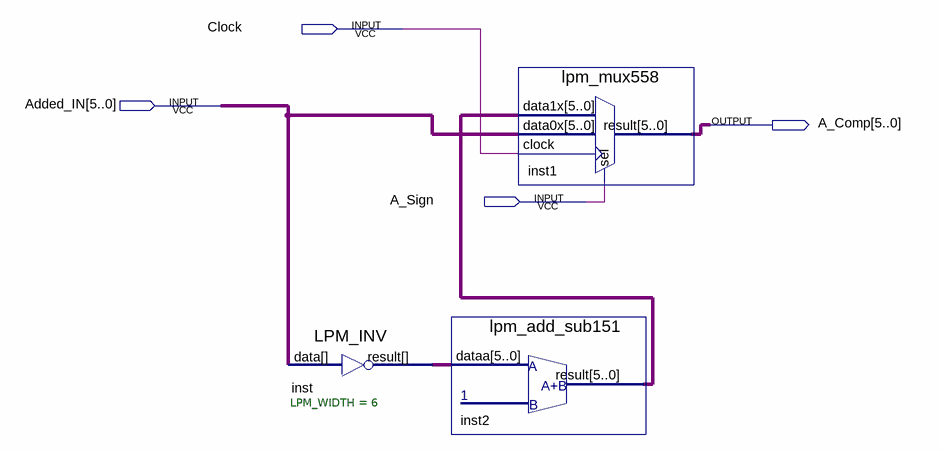
[diagram p0: schematic sheet]
// Quartus schematic Uncomplemetor.bdf as structural Verilog: 3 symbols, 4 pins
module Uncomplemetor (
  input  Clock,
  input  [5:0] Added_IN,
  input  A_Sign,
  output [5:0] A_Comp
);

  wire [5:0] inst2_result, inst_result;

  LPM_INV #(.LPM_WIDTH(6)) inst (.data(Added_IN), .result(inst_result));
  lpm_add_sub151 inst2 (.dataa(inst_result), .result(inst2_result));
  lpm_mux558 inst1 (.data1x(inst2_result), .data0x(Added_IN), .clock(Clock), .sel(A_Sign), .result(A_Comp));
endmodule
